# Altium project 实用电路_霜华TSP54540_5V@5A.PrjPcb
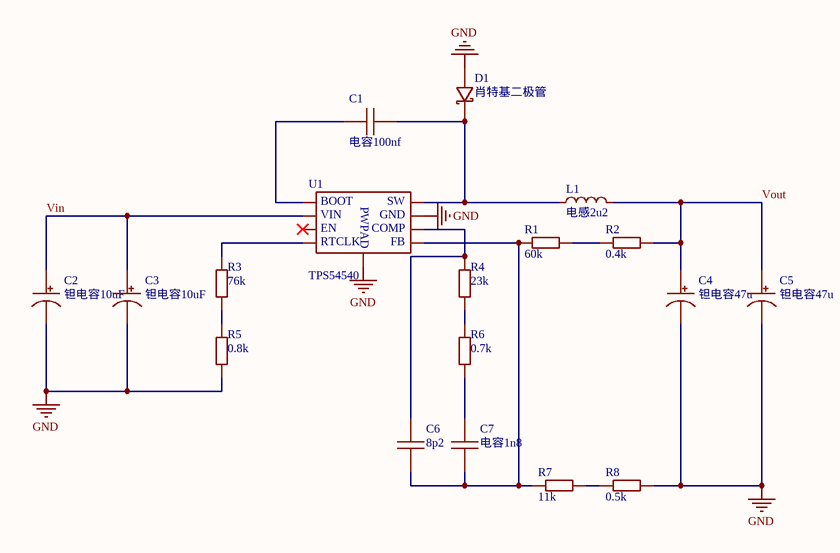
[diagram p0: V1.SchDoc]
1 sheet, 18 parts. Net scope: global (net labels, ports and power ports of the same name join across sheets).
Board file: V1.PcbDoc

## Sheet V1.SchDoc
size A4; SheetNumber: 1; SheetTotal: 1

### Parts
C1  电容100nf  [0603C]
C2  钽电容10uF  [3528B/1210]
C3  钽电容10uF  [3528B/1210]
C4  钽电容47u  [3528B/1210]
C5  钽电容47u  [3528B/1210]
C6  8p2  [0603C]
C7  电容1n8  [0603C]
D1  肖特基二极管  [SMA]
L1  电感2u2  [CD7X]
R1  60k  [0603R]
R2  0.4k  [0603R]
R3  76k  [0603R]
R4  23k  [0603R]
R5  0.8k  [0603R]
R6  0.7k  [0603R]
R7  11k  [0603R]
R8  0.5k  [0603R]
U1  TPS54540  [SOP-8-PP]

### Nets
GND: C2.2 C3.2 C4.2 C5.2 D1.1 R5.1 R8.2 U1.7 U1.9
Vin: C2.1 C3.1 U1.2
Vout: C4.1 C5.1 L1.2 R2.2
NetC1_1: C1.1 U1.1
NetC1_2: C1.2 D1.2 L1.1 U1.8
NetC6_1: C6.1 R4.2 U1.6
NetC6_2: C6.2 C7.2 R1.1 R7.1 U1.5
NetC7_1: C7.1 R6.1
NetR1_2: R1.2 R2.1
NetR3_1: R3.1 R5.2
NetR3_2: R3.2 U1.4
NetR4_1: R4.1 R6.2
NetR7_2: R7.2 R8.1

Not connected (* = marked no-connect by the designer): U1 3*

### Notes on the sheet
- (in symbol 芯片/IC-TPS54540) BOOT; SW; VIN; GND; PWPAD; EN; COMP; RTCLK; FB

### Library data of the parts
C1 C6 C7 = 电容_贴片
C2-C5 = 电容_贴片钽
D1 = 二极管_肖特基
L1 = 电感_贴片
R1-R8 = 电阻_贴片
U1 = 芯片/IC-TPS54540